# EAGLE design 20120508_Melody_Timer (EAGLE 5.11)
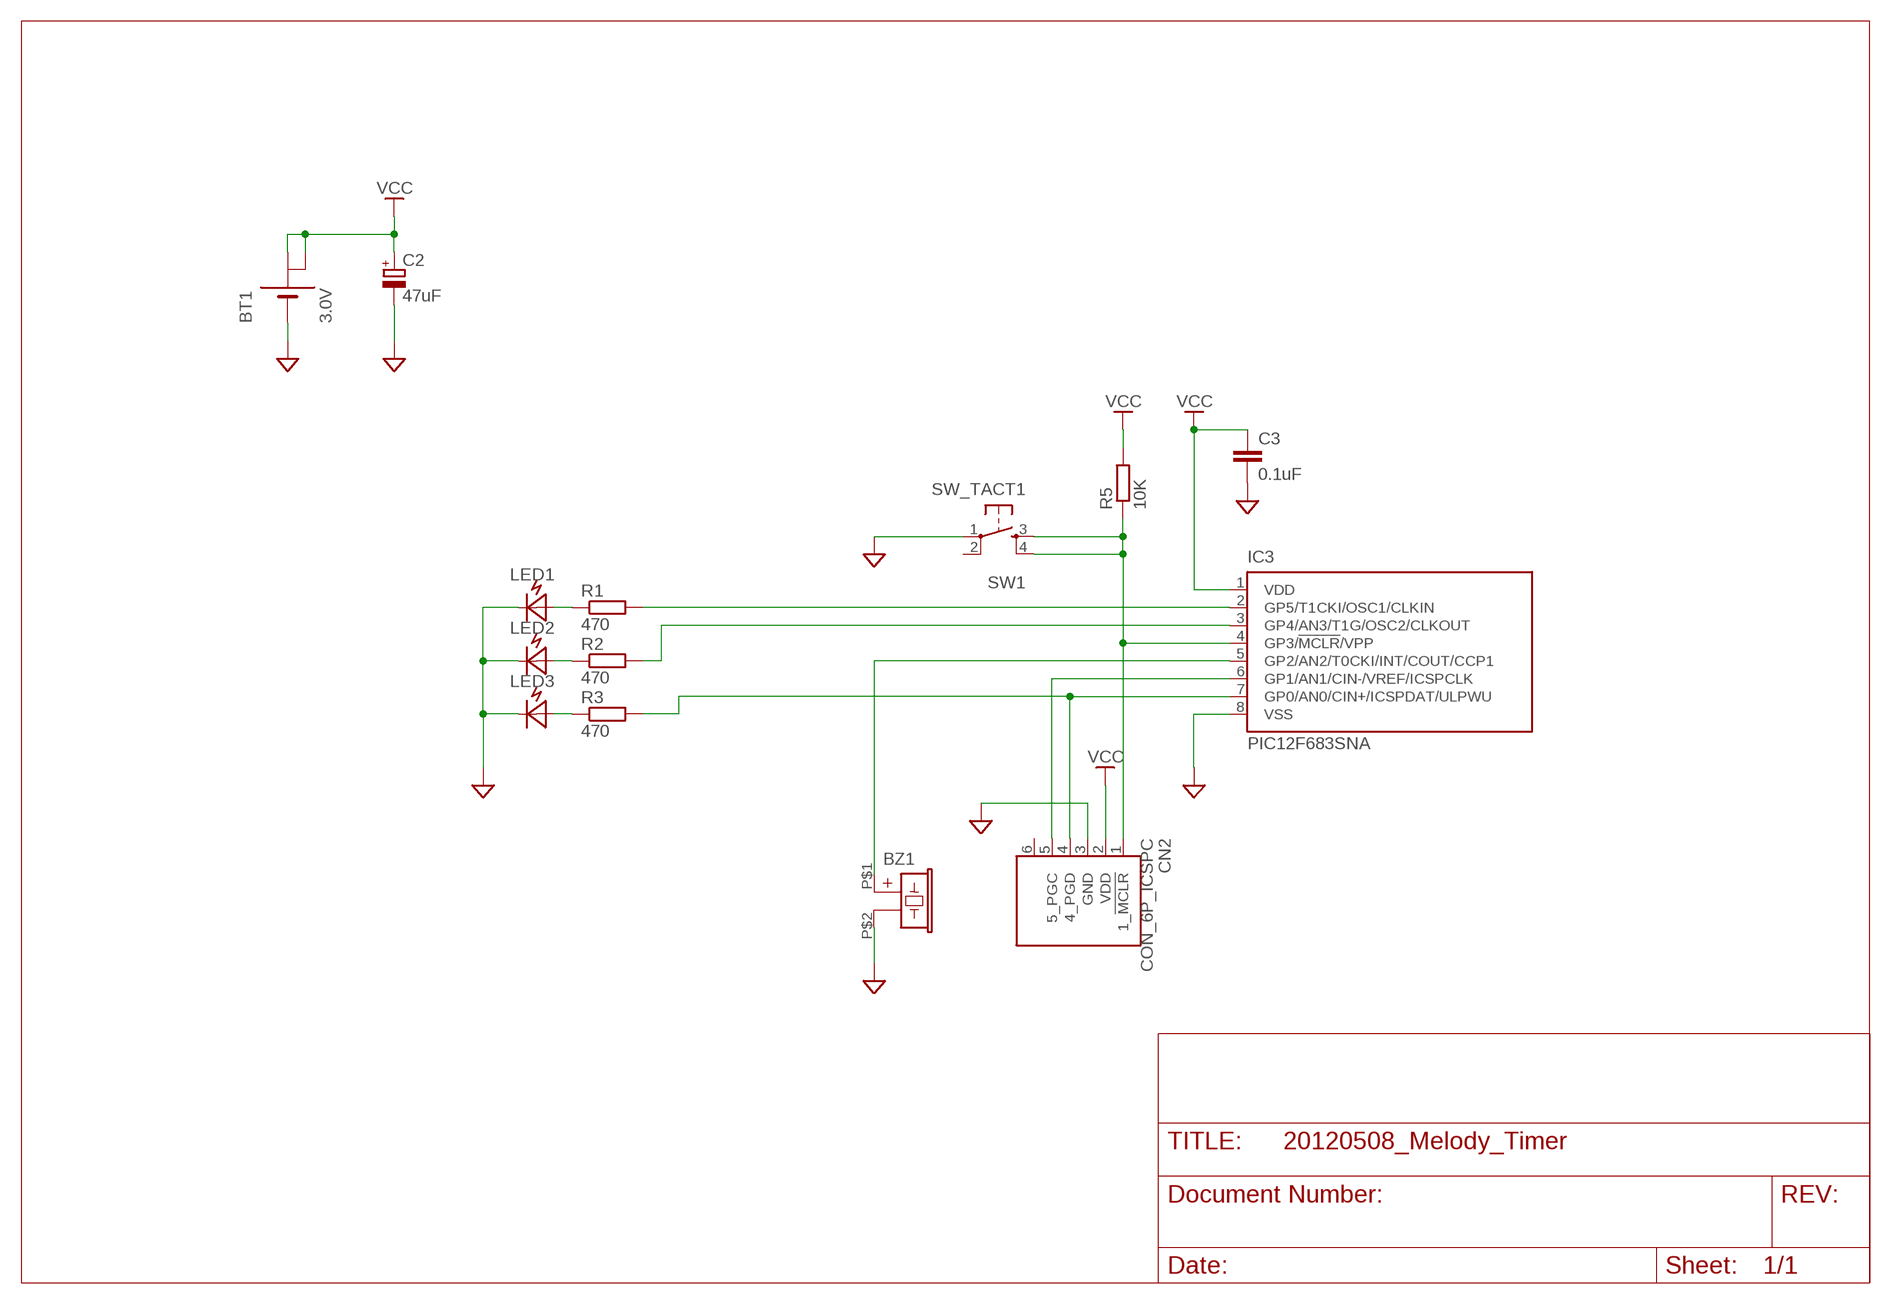
[diagram p0: schematic, sheet 1]

## Parts
BT1  3.0V  BATTERY_CS2B3  [BT_CR2032_VERT_B1]
BZ1  BUZZER-M1  [BZ_MURATA_PKLCS_1212E4001]
C2  47uF  CPOL-CHP_M3528  [M3528P]
C3  0.1uF  C-EU2050-025X075A  [C050-025X075-A]
CN2  CON_6P_ICSPC  [CON_HRS_DIP_6B]
IC3  PIC12F683SNA  [SO-08A]
LED1  LED""  [LED_3MM_VIRT_2]
LED2  LED""  [LED_3MM_VIRT_2]
LED3  LED""  [LED_3MM_VIRT_2]
R1  470  R-EU20204/5A  [0204/5-A]
R2  470  R-EU20204/5A  [0204/5-A]
R3  470  R-EU20204/5A  [0204/5-A]
R5  10K  R-EU20204/5A  [0204/5-A]
SW1  SW_TACT1  [SW_TACT]

## Nets
GND: BT1.- BZ1.P$2(-) C2.- C3.2 CN2.3(GND) IC3.8(VSS) LED1.K LED2.K LED3.K SW1.1(P)
N$2: CN2.5(5_PGC) IC3.6(GP1/AN1/CIN-/VREF/ICSPCLK)
N$3: CN2.4(4_PGD) IC3.7(GP0/AN0/CIN+/ICSPDAT/ULPWU) R3.2
N$5: BZ1.P$1(+) IC3.5(GP2/AN2/T0CKI/INT/COUT/CCP1)
N$6: LED3.A R3.1
N$7: LED2.A R2.1
N$8: LED1.A R1.1
N$9: IC3.2(GP5/T1CKI/OSC1/CLKIN) R1.2
N$10: IC3.3(GP4/AN3/T1G/OSC2/CLKOUT) R2.2
N$13: CN2.1(1_!MCLR) IC3.4(GP3/!MCLR!/VPP) R5.1 SW1.3(S) SW1.4(S1)
VCC: BT1.+1 BT1.+2 C2.+ C3.1 CN2.2(VDD) IC3.1(VDD) R5.2
Unconnected: CN2.6 SW1.2(P1)

## Library data of the parts
BT1 = p20120508_Melody_Timer:BATTERY_CS2: Battery CR2032 case
BZ1 = p20120508_Melody_Timer:BUZZER: Piezo Buzzer
C2 = p20120508_Melody_Timer:CPOL-CHP: POLARIZED CAPACITOR, European symbol
C3 = p20120508_Melody_Timer:C-EU2: CAPACITOR, European symbol
CN2 = p20120508_Melody_Timer:CON_6P_ICSP
IC3 = p20120508_Melody_Timer:PIC12F683: 8-Pin Flash-Based, 8-Bit CMOS Microcontrollers with nanoWatt Technology Source: http://ww1.microchip.com/downloads/en/DeviceDoc/41211D_.pdf
LED1-LED3 = p20120508_Melody_Timer:LED: 3mm LED
R1-R3 R5 = p20120508_Melody_Timer:R-EU2: RESISTOR, European symbol
SW1 = p20120508_Melody_Timer:SW_TACT: Tacticle Push Switch

## Net classes
0 default: width 0.406 mm, clearance 0.254 mm
1 power: width 0.508 mm, clearance 0.254 mm

## Board
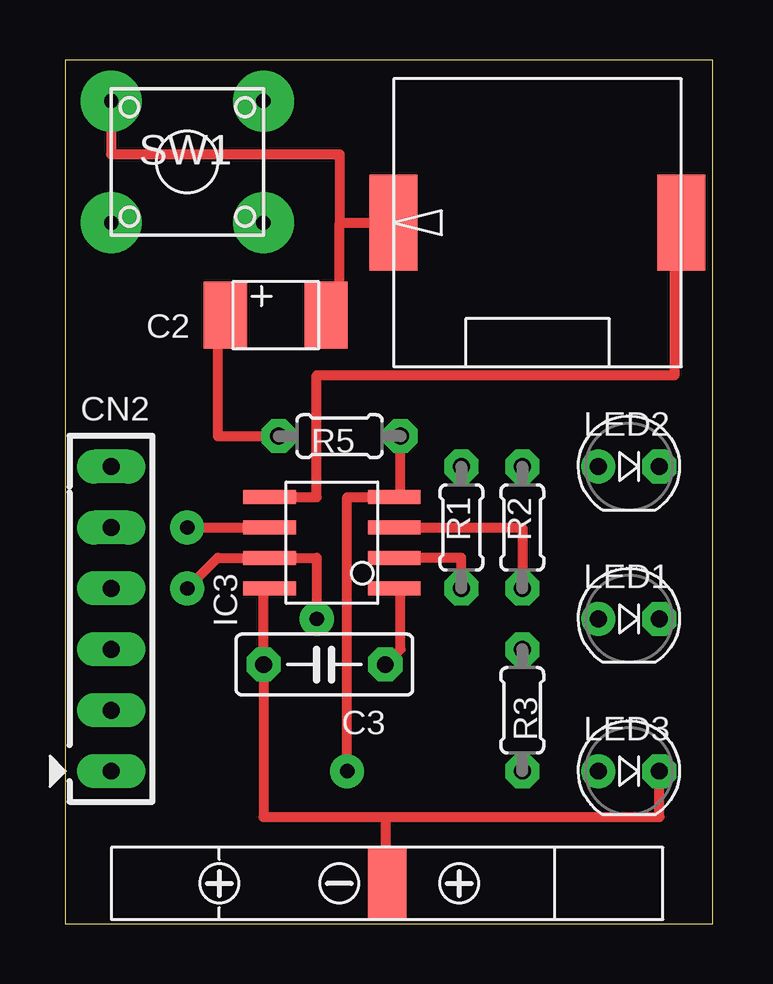
[diagram p1: board, top side]
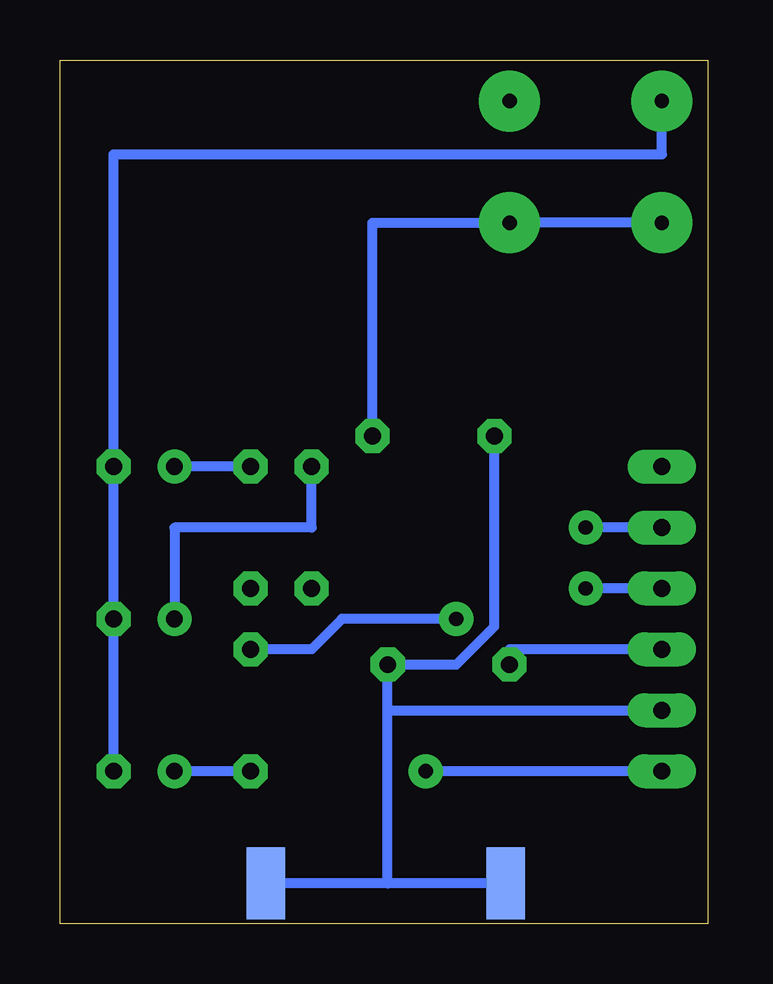
[diagram p2: board, bottom side, seen from below]

Size 27 x 36 mm. Coordinates in mm from the lower left corner, seen from the top.
Outline: 0,0 27,0 27,36 0,36 0,0
Copper layers (1*16): Top 0.035mm / dielectric 1.5mm / Bottom 0.035mm
Design rules "default": minimum track width 10mil, minimum drill 24mil, track to track 8mil, track to pad 8mil, pad to pad 8mil, via to via 8mil, smd to smd 8mil, copper to edge 40mil, drill to drill 8mil, minimum pad ring 10mil, minimum via ring 8mil, stop-mask expansion 4mil, vias tented up to drill 0mil, thermal gap 10mil

### Footprints (pad centres in the part's own frame; a part is rotated, then mirrored left to right if it is on the bottom)
BT_CR2032_VERT_B1 = smd 3 x 1.6 bottom: +1 -1.5,5; +2 -1.5,-5 | smd 3 x 1.6: - -1.5,0
BZ_MURATA_PKLCS_1212E4001 = smd 2 x 4: P$1 -6,0; P$2 6,0
M3528P = smd 1.8 x 2.8: + -2.105,0.005; - 2.095,0.005
C050-025X075-A = drill 0.7 pad 1.422 octagon: 1 -2.54,0; 2 2.54,0
CON_HRS_DIP_6B = drill 0.7 pad 1.422 long: 1 -6.35,0; 2 -3.81,0; 3 -1.27,0; 4 1.27,0; 5 3.81,0; 6 6.35,0
SO-08A = smd 0.6 x 2.2: 1 -1.905,-2.6; 2 -0.635,-2.6; 3 0.635,-2.6; 4 1.905,-2.6; 5 1.905,2.6; 6 0.635,2.6; 7 -0.635,2.6; 8 -1.905,2.6
LED_3MM_VIRT_2 = drill 0.7 pad 1.422 round: A -1.27,0 | drill 0.7 pad 1.422 octagon: K 1.27,0
0204/5-A = drill 0.7 pad 1.422 octagon: 1 -2.54,0; 2 2.54,0
SW_TACT = drill 0.6 pad 2.54 round: 1 -3.175,2.54; 2 3.175,2.54; 3 -3.175,-2.54; 4 3.175,-2.54

### Placement (x,y rotation side)
BT1  13.41,3.17 90 top
BZ1  19.68,29.21 180 top
C2  8.78,25.36 0 top
C3  10.79,10.79 180 top
CN2  1.91,12.7 90 top
IC3  11.11,15.88 90 top
LED1  23.5,12.7 0 top
LED2  23.5,19.05 0 top
LED3  23.5,6.35 0 top
R1  16.51,16.51 270 top
R2  19.05,16.51 270 top
R3  19.05,8.89 90 top
R5  11.43,20.32 180 top
SW1  5.08,31.75 0 top

### Tracks (layer width: path | path; a pad name or v marks a point on that pad's centre or on a via)
GND
  Top 0.406: BT1.- 13.34,1.68 13.34,4.45 | 13.34,4.45 24.77,4.45 LED3.K | IC3.8 8.26,13.97 C3.2 8.26,4.45 13.34,4.45 | 11.43,29.21 BZ1.P$2 | 11.43,29.21 11.43,32.07 1.91,32.07 SW1.1 | C2.- 11.43,25.36 11.43,29.21
  Bottom 0.406: LED3.K LED1.K LED2.K 24.77,32.07 1.91,32.07 SW1.1 | CN2.3 8.26,11.43 C3.2
N$2  (via drill 0.6 pad 1.42)
  Top 0.406: v5.08,16.51 IC3.6
  Bottom 0.406: CN2.5 v5.08,16.51
N$3  (via drill 0.6 pad 1.42)
  Top 0.406: v10.48,12.7 10.48,15.24 IC3.7 6.35,15.24 v5.08,13.97
  Bottom 0.406: CN2.4 v5.08,13.97 | v10.48,12.7 15.24,12.7 16.51,11.43 R3.2
N$5
  Top 0.406: IC3.5 10.48,17.78 10.48,22.86 25.4,22.86 25.4,28.93 BZ1.P$1
N$6
  Bottom 0.406: R3.1 LED3.A
N$7
  Bottom 0.406: R2.1 LED2.A
N$8
  Bottom 0.406: R1.1 16.51,16.51 22.23,16.51 LED1.A
N$9
  Top 0.406: IC3.2 16.51,15.24 R1.2
N$10
  Top 0.406: IC3.3 19.05,16.51 R2.2
N$13  (via drill 0.6 pad 1.42)
  Top 0.406: R5.1 13.97,17.78 IC3.4 11.75,17.78 v11.75,6.35
  Bottom 0.406: CN2.1 v11.75,6.35 | R5.1 13.97,29.21 SW1.4 SW1.3
VCC
  Top 0.406: IC3.1 13.97,13.97 13.97,11.43 C3.1 | C2.+ 6.35,25.36 6.35,20.32 R5.2
  Bottom 0.406: 13.34,1.68 13.34,8.89 | 13.34,8.89 C3.1 10.48,10.79 8.89,12.38 R5.2 | 13.34,8.89 CN2.2 | BT1.+1 13.34,1.68 | 13.34,1.68 BT1.+2